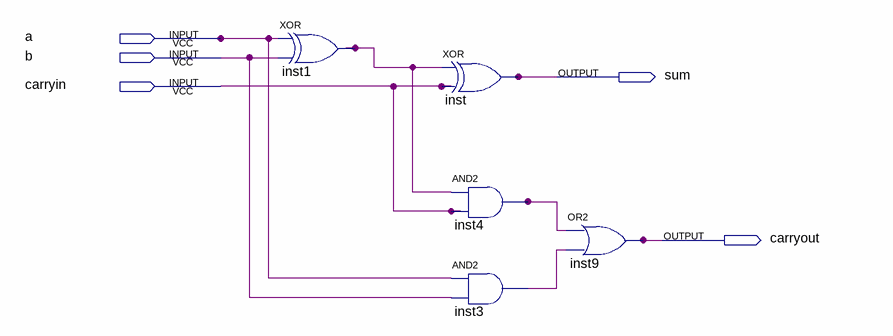
[diagram p0: schematic sheet]
// Quartus schematic fulladder.bdf as structural Verilog: 5 symbols, 5 pins
module fulladder (
  input  a,
  input  b,
  input  carryin,
  output sum,
  output carryout
);

  wire inst1_out, inst3_out, inst4_out;

  xor inst1 (inst1_out, a, b);
  xor inst (sum, inst1_out, carryin);
  and inst4 (inst4_out, inst1_out, carryin);
  and inst3 (inst3_out, a, b);
  or inst9 (carryout, inst4_out, inst3_out);
endmodule
